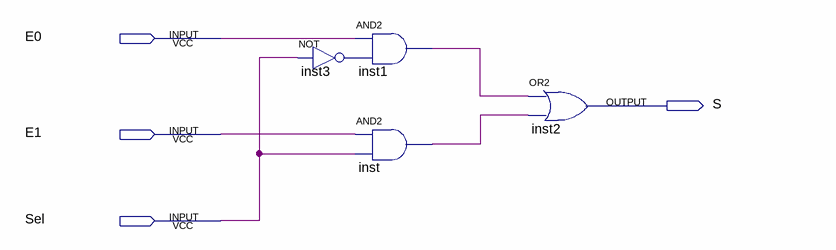
[diagram p0: schematic sheet]
// Quartus schematic multiplex_divisao.bdf as structural Verilog: 4 symbols, 4 pins
module multiplex_divisao (
  input  E0,
  input  E1,
  input  Sel,
  output S
);

  wire inst1_out, inst3_out, inst_out;

  not inst3 (inst3_out, Sel);
  and inst1 (inst1_out, E0, inst3_out);
  and inst (inst_out, E1, Sel);
  or inst2 (S, inst1_out, inst_out);
endmodule
